# Altium schematic sheet Sheet_1_2024-03-04.schdoc
size 549 x 899 mm
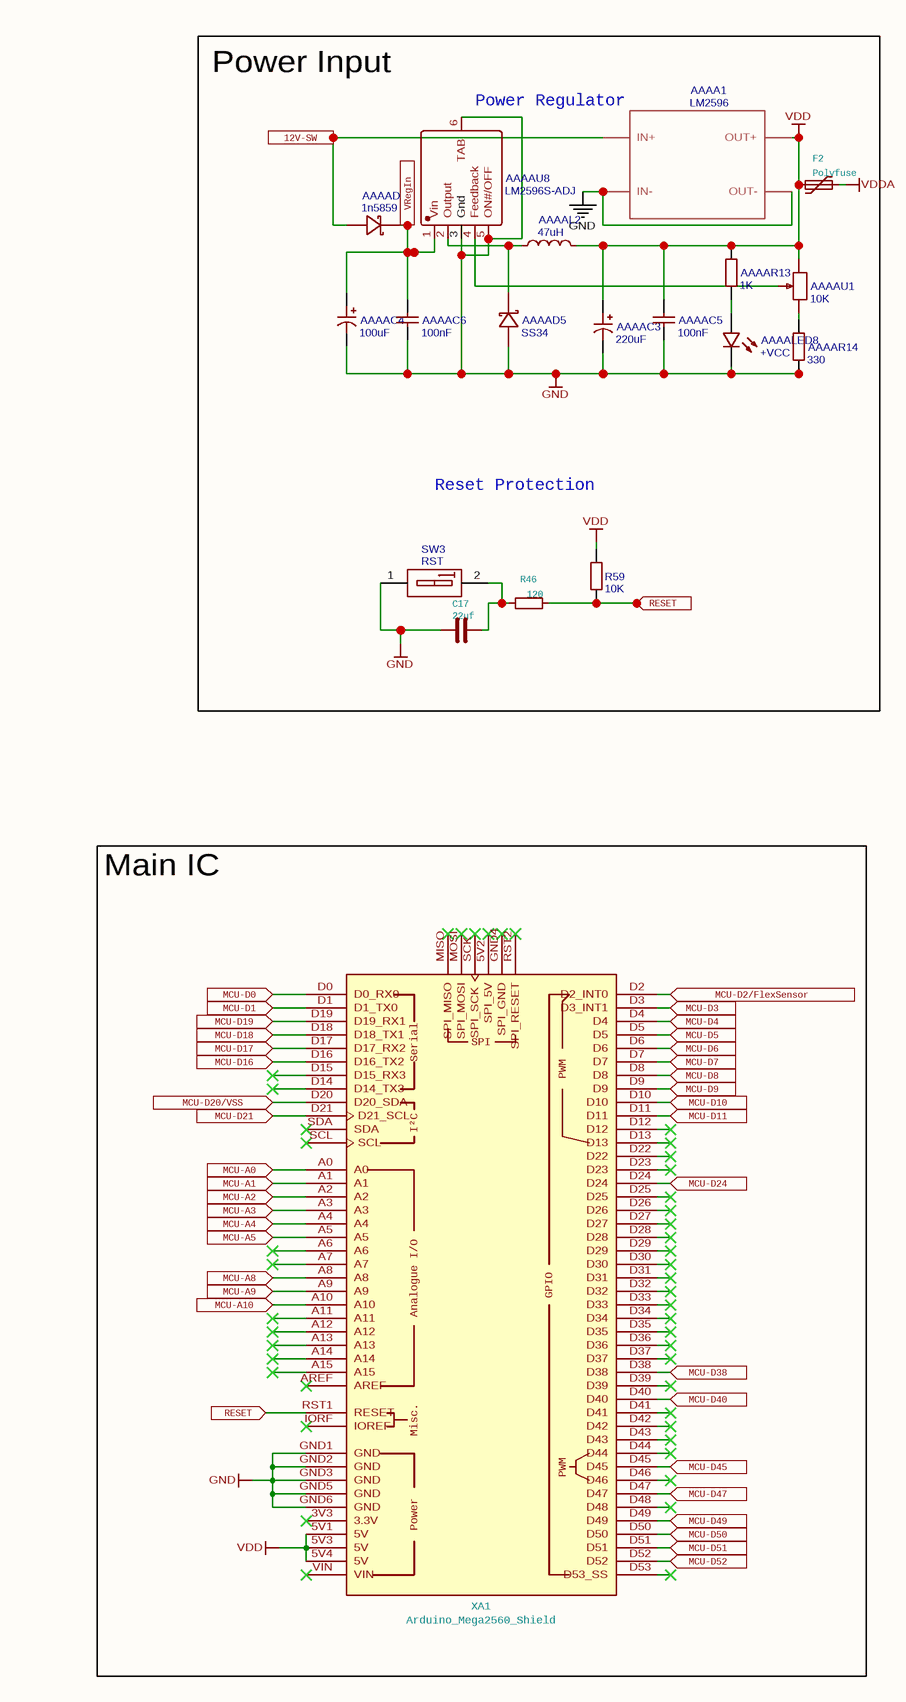
[diagram p0: Sheet_1_2024-03-04.schdoc, top left]
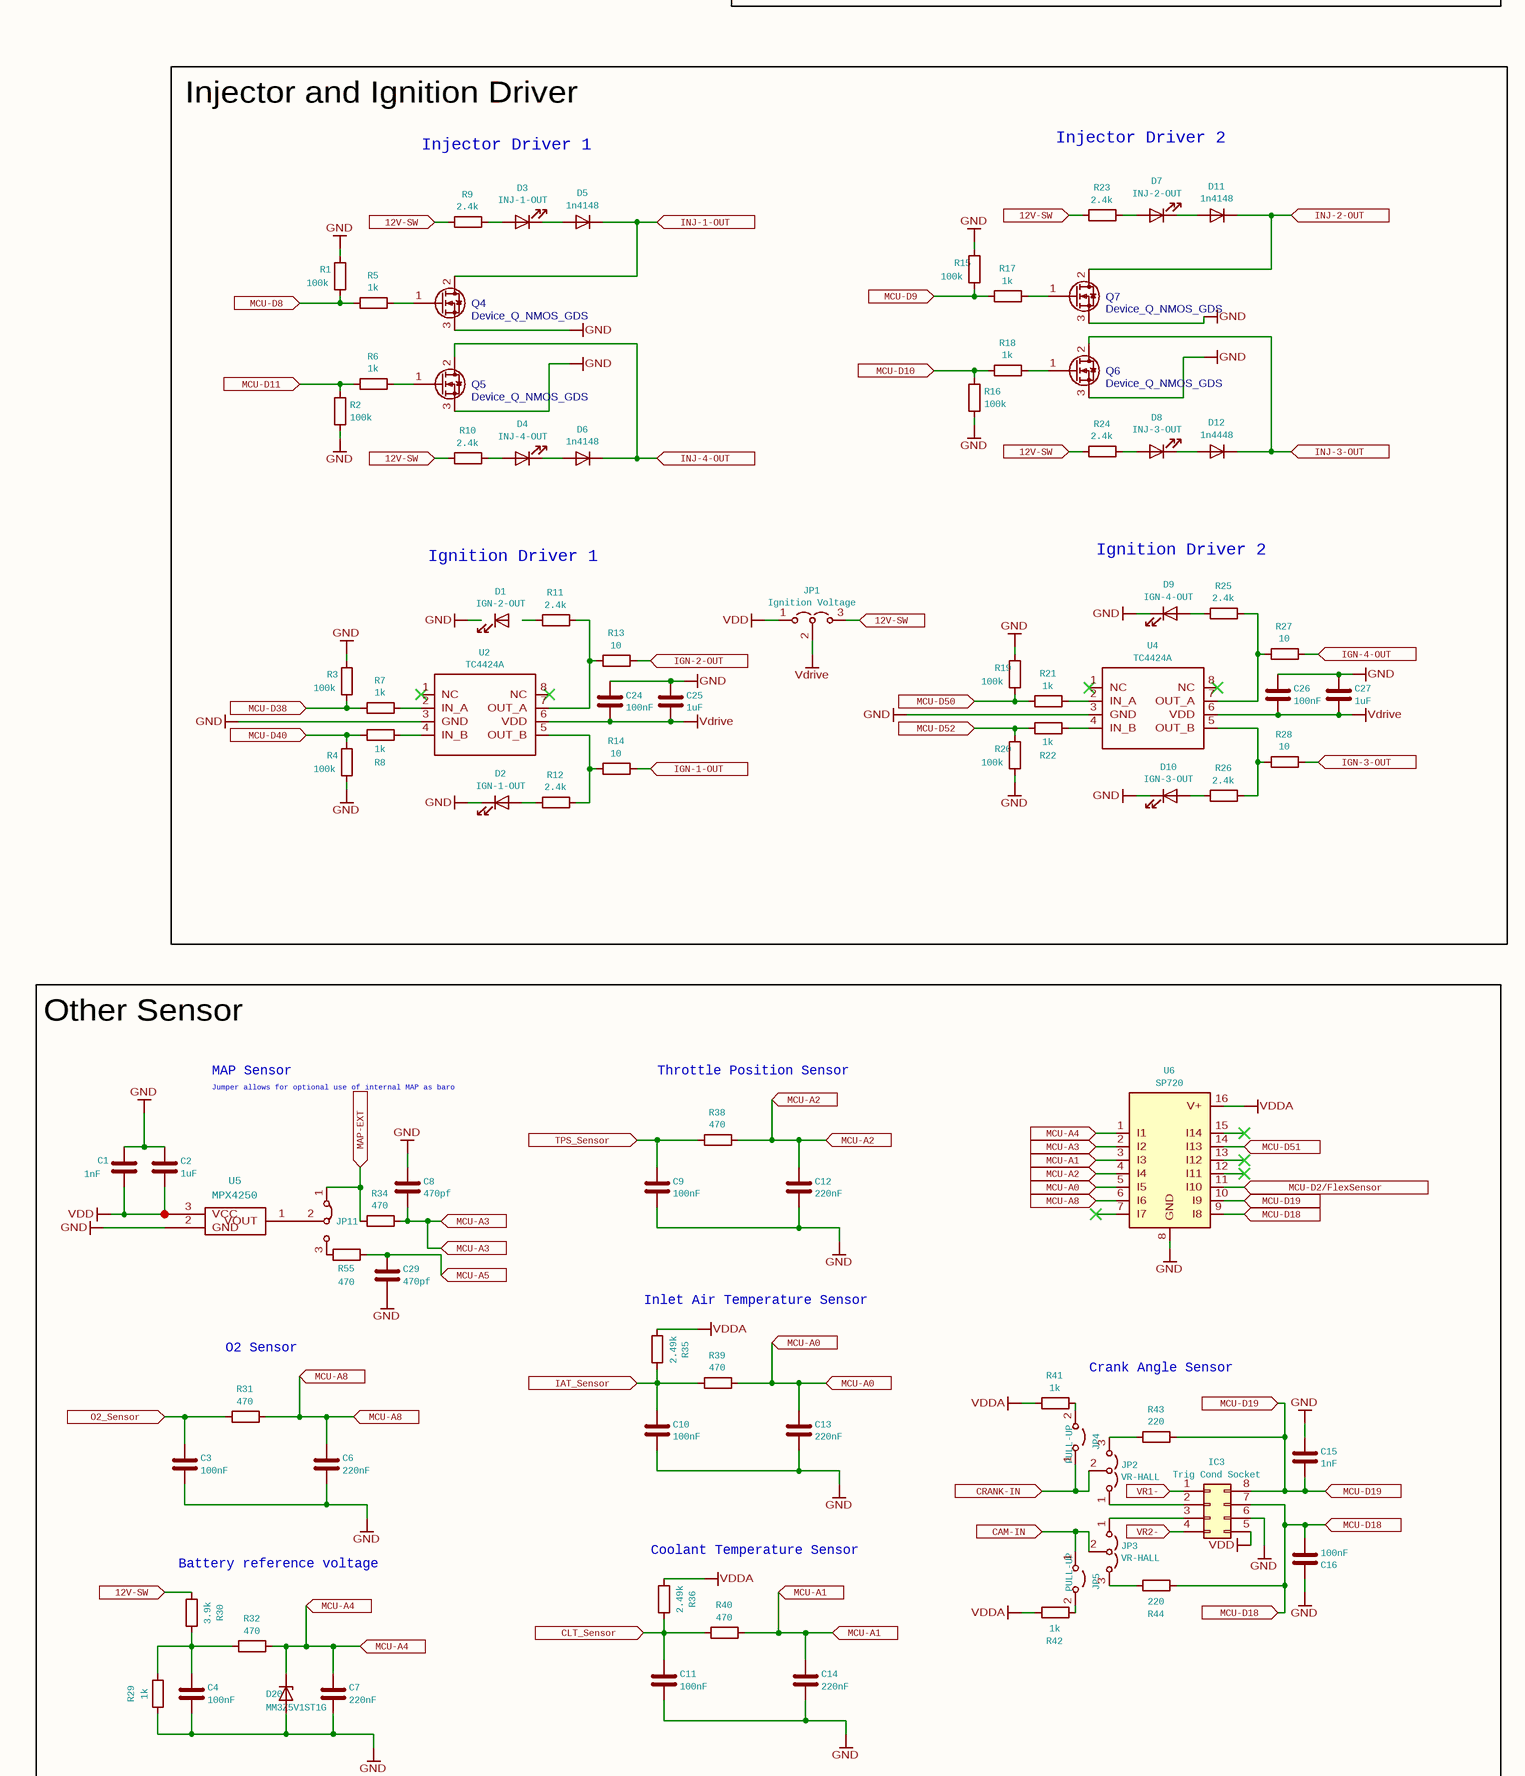
[diagram p1: Sheet_1_2024-03-04.schdoc, centre left]
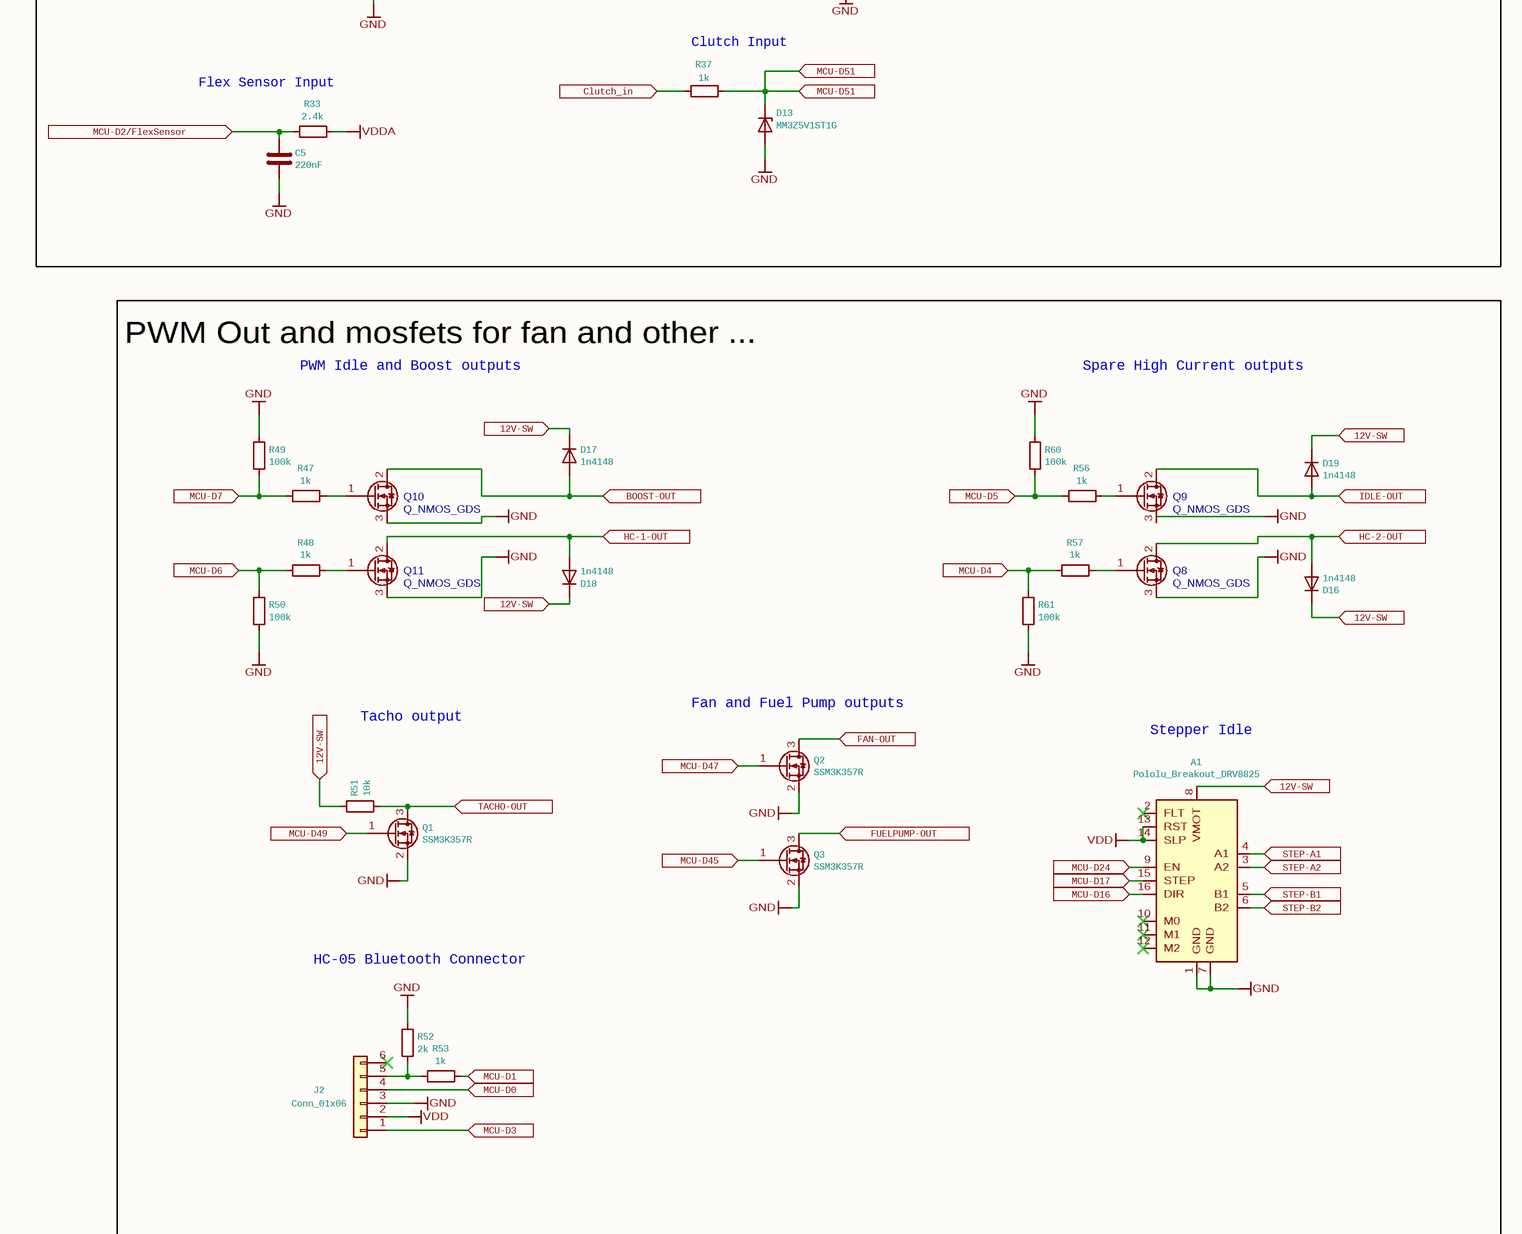
[diagram p2: Sheet_1_2024-03-04.schdoc, bottom left]
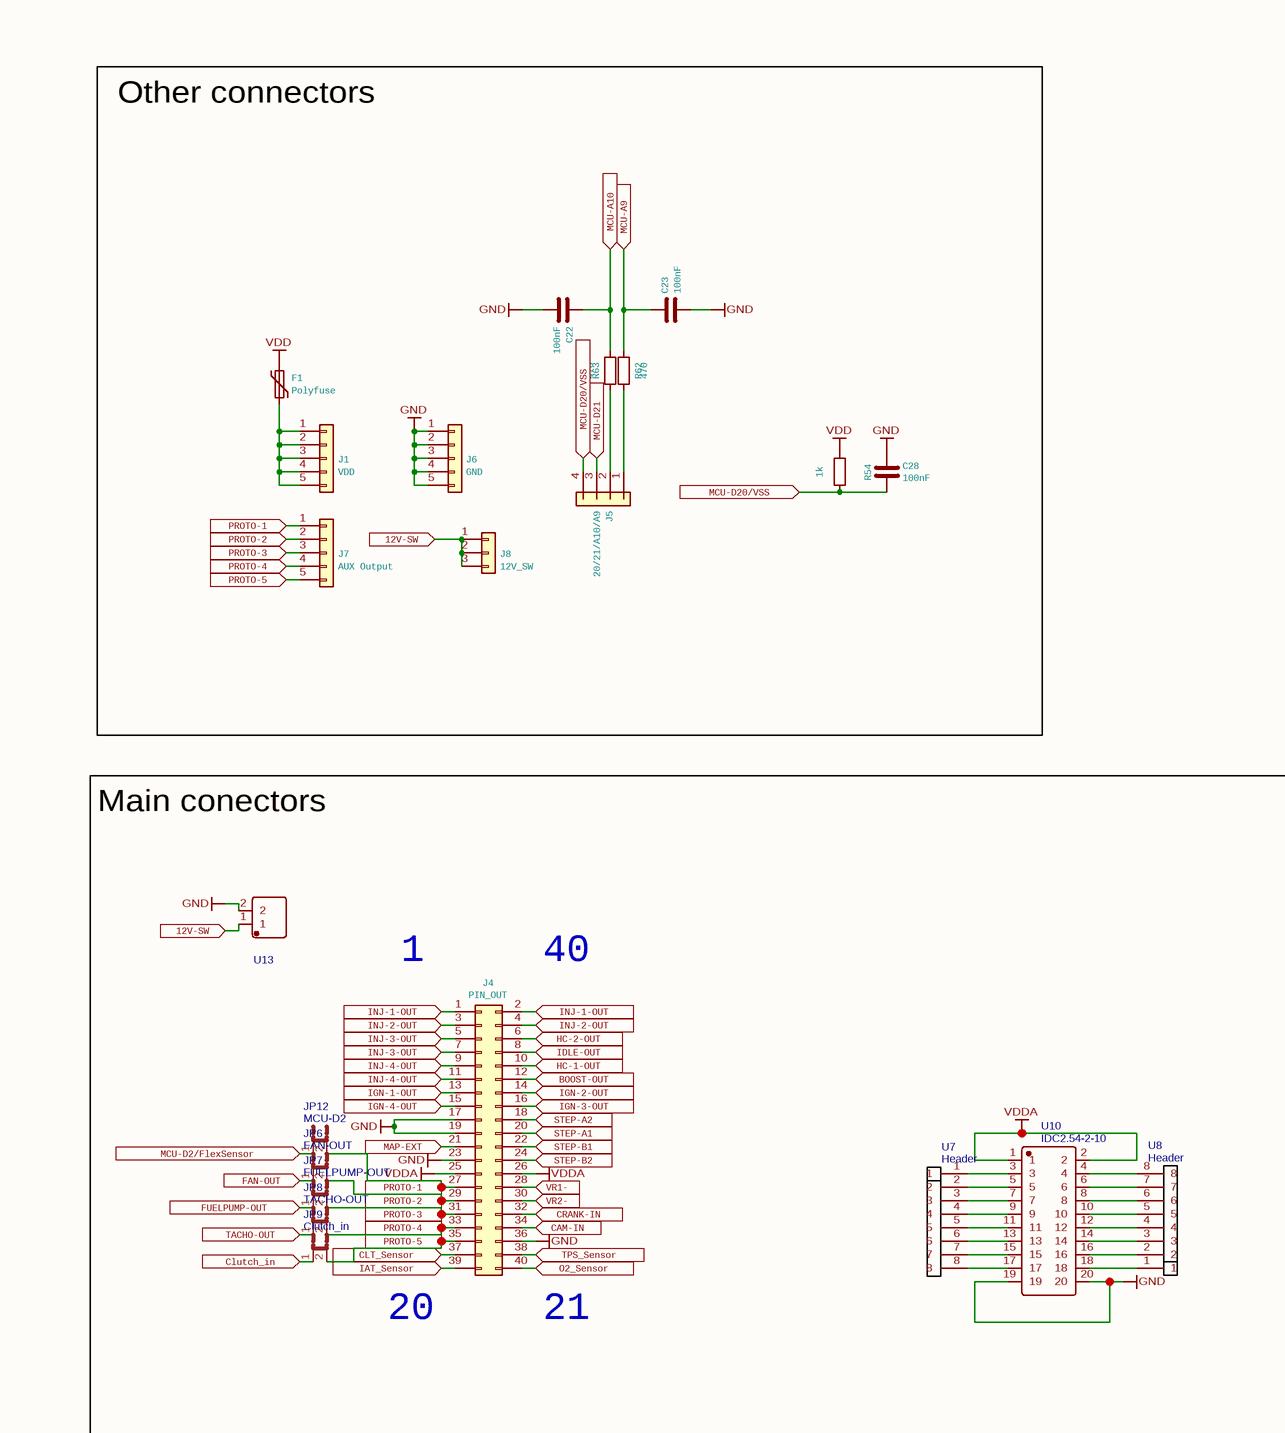
[diagram p3: Sheet_1_2024-03-04.schdoc, bottom right]

## Parts
A1  Pololu_Breakout_DRV8825  [POLOLU_BREAKOUT-16_15.2X20.3MM]
AAAA1  LM2596  [DC-DC-STEP-DOWN-LM2596]
AAAAC3  220uF  [CAP SMD 6.3 ~ 8 DIP 25V]
AAAAC4  100uF  [CAP SMD 6.3 ~ 8 DIP 25V]
AAAAC5  100nF  [C0805]
AAAAC6  100nF  [C0805]
AAAAD1  1n5859  [SMA_L4.3-W2.6-LS5.1-RD]
AAAAD5  SS34  [SMA_L4.3-W2.6-LS5.1-RD]
AAAAL2  47uH  [IND-SMD_L12.3-W12.3_SMDRI127]
AAAALED8  +VCC  [LED0805-R-RD]
AAAAR13  1K  [R0805]
AAAAR14  330  [R0805]
AAAAU1  10K  [RES-ADJ-SMD_SMD33-10K]
AAAAU8  LM2596S-ADJ  [TO-263-5_L10.2-W8.9-P1.70-BR]
C1  1nF  [C_0805_2012METRIC]
C2  1uF  [C_0805_2012METRIC]
C3  100nF  [C_0805_2012METRIC]
C4  100nF  [C_0805_2012METRIC]
C5  220nF  [C_0805_2012METRIC]
C6  220nF  [C_0805_2012METRIC]
C7  220nF  [C_0805_2012METRIC]
C8  470pf  [C_0805_2012METRIC]
C9  100nF  [C_0805_2012METRIC]
C10  100nF  [C_0805_2012METRIC]
C11  100nF  [C_0805_2012METRIC]
C12  220nF  [C_0805_2012METRIC]
C13  220nF  [C_0805_2012METRIC]
C14  220nF  [C_0805_2012METRIC]
C15  1nF  [C_0805_2012METRIC]
C16  100nF  [C_0805_2012METRIC]
C17  22uf  [C_0805_2012METRIC]
C22  100nF  [C_0805_2012METRIC]
C23  100nF  [C_0805_2012METRIC]
C24  100nF  [C_0805_2012METRIC]
C25  1uF  [C_0805_2012METRIC]
C26  100nF  [C_0805_2012METRIC]
C27  1uF  [C_0805_2012METRIC]
C28  100nF  [C_0805_2012METRIC]
C29  470pf  [C_0805_2012METRIC]
D1  IGN-2-OUT  [LED0805_RED]
D2  IGN-1-OUT  [LED0805_RED]
D3  INJ-1-OUT  [LED0805_RED]
D4  INJ-4-OUT  [LED0805_RED]
D5  1n4148  [D_SOD-323]
D6  1n4148  [D_SOD-323]
D7  INJ-2-OUT  [LED0805_RED]
D8  INJ-3-OUT  [LED0805_RED]
D9  IGN-4-OUT  [LED0805_RED]
D10  IGN-3-OUT  [LED0805_RED]
D11  1n4148  [D_SOD-323]
D12  1n4448  [D_SOD-323]
D13  MM3Z5V1ST1G  [D_SOD-323]
D16  1n4148  [D_SOD-123F]
D17  1n4148  [D_SOD-123F]
D18  1n4148  [D_SOD-123F]
D19  1n4148  [D_SOD-123F]
D20  MM3Z5V1ST1G  [D_SOD-323]
F1  Polyfuse  [FUSE_1812_4532METRIC]
F2  Polyfuse  [FUSE_1812_4532METRIC]
IC3  Trig Cond Socket  [DIP-8_W7.62MM_SOCKET]
J1  VDD  [PINHEADER_1X05_P2.54MM_VERTICAL]
J2  Conn_01x06  [PINHEADER_1X06_P2.54MM_VERTICAL]
J4  PIN_OUT  [IDC-HEADER_2X20_P2.54MM_VERTICAL]
J5  20/21/A10/A9  [PINHEADER_1X04_P2.54MM_VERTICAL]
J6  GND  [PINHEADER_1X05_P2.54MM_VERTICAL]
J7  AUX Output  [PINHEADER_1X05_P2.54MM_VERTICAL]
J8  12V_SW  [PINHEADER_1X03_P2.54MM_VERTICAL]
JP1  Ignition Voltage  [PINHEADER_1X03_P2.54MM_VERTICAL]
JP2  VR-HALL  [PINHEADER_1X03_P2.54MM_VERTICAL]
JP3  VR-HALL  [PINHEADER_1X03_P2.54MM_VERTICAL]
JP4  PULL-UP  [PINHEADER_1X02_P2.54MM_VERTICAL]
JP5  PULL-UP  [PINHEADER_1X02_P2.54MM_VERTICAL]
JP6  FAN-OUT  [JUMPER 2X1 (PIN= 2.54) SMD(0805)]
JP7  FUELPUMP-OUT  [JUMPER 2X1 (PIN= 2.54) SMD(0805)]
JP8  TACHO-OUT  [JUMPER 2X1 (PIN= 2.54) SMD(0805)]
JP9  Clutch_in  [JUMPER 2X1 (PIN= 2.54) SMD(0805)]
JP11  Jumper_MPX  [RES-ADJ-SMD_3P-10K-3-3]  (value not drawn)
JP12  MCU-D2  [JUMPER 2X1 (PIN= 2.54) SMD(0805)]
Q1  SSM3K357R  [SOT-23]
Q2  SSM3K357R  [SOT-23]
Q3  SSM3K357R  [SOT-23]
Q4  Device_Q_NMOS_GDS  [TO-220_Q_NMOS_GDS]
Q5  Device_Q_NMOS_GDS  [TO-220_Q_NMOS_GDS]
Q6  Device_Q_NMOS_GDS  [TO-220_Q_NMOS_GDS]
Q7  Device_Q_NMOS_GDS  [TO-220_Q_NMOS_GDS]
Q8  Q_NMOS_GDS  [TO-220_Q_NMOS_GDS]
Q9  Q_NMOS_GDS  [TO-220_Q_NMOS_GDS]
Q10  Q_NMOS_GDS  [TO-220_Q_NMOS_GDS]
Q11  Q_NMOS_GDS  [TO-220_Q_NMOS_GDS]
R1  100k  [R_0805_2012METRIC]
R2  100k  [R_0805_2012METRIC]
R3  100k  [R_0805_2012METRIC]
R4  100k  [R_0805_2012METRIC]
R5  1k  [R_0805_2012METRIC]
R6  1k  [R_0805_2012METRIC]
R7  1k  [R_0805_2012METRIC]
R8  1k  [R_0805_2012METRIC]
R9  2.4k  [R_0805_2012METRIC]
R10  2.4k  [R_0805_2012METRIC]
R11  2.4k  [R_0805_2012METRIC]
R12  2.4k  [R_0805_2012METRIC]
R13  10  [R_1206_3216METRIC]
R14  10  [R_1206_3216METRIC]
R15  100k  [R_0805_2012METRIC]
R16  100k  [R_0805_2012METRIC]
R17  1k  [R_0805_2012METRIC]
R18  1k  [R_0805_2012METRIC]
R19  100k  [R_0805_2012METRIC]
R20  100k  [R_0805_2012METRIC]
R21  1k  [R_0805_2012METRIC]
R22  1k  [R_0805_2012METRIC]
R23  2.4k  [R_0805_2012METRIC]
R24  2.4k  [R_0805_2012METRIC]
R25  2.4k  [R_0805_2012METRIC]
R26  2.4k  [R_0805_2012METRIC]
R27  10  [R_1206_3216METRIC]
R28  10  [R_1206_3216METRIC]
R29  1k  [R_0805_2012METRIC]
R30  3.9k  [R_0805_2012METRIC]
R31  470  [R_0805_2012METRIC]
R32  470  [R_0805_2012METRIC]
R33  2.4k  [R_0805_2012METRIC]
R34  470  [R_0805_2012METRIC]
R35  2.49k  [R_0805_2012METRIC]
R36  2.49k  [R_0805_2012METRIC]
R37  1k  [R_0805_2012METRIC]
R38  470  [R_0805_2012METRIC]
R39  470  [R_0805_2012METRIC]
R40  470  [R_0805_2012METRIC]
R41  1k  [R_0805_2012METRIC]
R42  1k  [R_0805_2012METRIC]
R43  220  [R_0805_2012METRIC]
R44  220  [R_0805_2012METRIC]
R46  120  [R_0805_2012METRIC]
R47  1k  [R_0805_2012METRIC]
R48  1k  [R_0805_2012METRIC]
R49  100k  [R_0805_2012METRIC]
R50  100k  [R_0805_2012METRIC]
R51  10k  [R_0805_2012METRIC]
R52  2k  [R_0805_2012METRIC]
R53  1k  [R_0805_2012METRIC]
R54  1k  [R_0805_2012METRIC]
R55  470  [R_0805_2012METRIC]
R56  1k  [R_0805_2012METRIC]
R57  1k  [R_0805_2012METRIC]
R59  10K  [R0805]
R60  100k  [R_0805_2012METRIC]
R61  100k  [R_0805_2012METRIC]
R62  470  [R_0805_2012METRIC]
R63  470  [R_0805_2012METRIC]
SW3  RST  [SW-SMD_L5.4-W2.8-LS8.2]
U2  TC4424A  [SOIC-8_3.9X4.9MM_P1.27MM]
U4  TC4424A  [SOIC-8_3.9X4.9MM_P1.27MM]
U5  MPX4250  [MPX4250]
U6  SP720  [SOIC-16_3.9X9.9MM_P1.27MM]
U7  Header  [1X8 HEADER (PIN = 2.54)]
U8  Header  [1X8 HEADER (PIN = 2.54)]
U10  IDC2.54-2-10  [IDC-TH_20P-P2.54_ZX-IDC2.54-2-10PZZ]
U13  Power Input  [PHONIX 2PIN (5.08MM)]  (value not drawn)
XA1  Arduino_Mega2560_Shield  [ARDUINO_MEGA2560_SHIELD_IO_ONLY]

## Blocks framed on the sheet
Power Input: AAAA1 AAAAC3-AAAAC6 AAAAD1 AAAAD5 AAAAL2 AAAALED8 AAAAR13 AAAAR14 AAAAU1 AAAAU8 C17 F2 R46 R59 SW3
Main IC: XA1
Injector and Ignition Driver: C24-C27 D1-D12 JP1 Q4-Q7 R1-R28 U2 U4
Other Sensor: C1-C16 C29 D13 D20 IC3 JP2-JP5 JP11 R29-R44 R55 U5 U6
Other connectors: C22 C23 C28 F1 J1 J5-J8 R54 R62 R63
PWM Out and mosfets for fan and other ...: A1 D16-D19 J2 Q1-Q3 Q8-Q11 R47-R53 R56 R57 R60 R61

## Ports
12V-SW (in), BOOST-OUT (in), CAM-IN (in), CLT_Sensor (in), Clutch_in (in), CRANK-IN (in), FAN-OUT (in), FUELPUMP-OUT (in), HC-1-OUT (in), HC-2-OUT (in), IAT_Sensor (in), IDLE-OUT (in), IGN-1-OUT (in), IGN-2-OUT (in), IGN-3-OUT (in), IGN-4-OUT (in), INJ-1-OUT (in), INJ-2-OUT (in), INJ-3-OUT (in), INJ-4-OUT (in), MAP-EXT (in), MCU-A0 (in), MCU-A1 (in), MCU-A2 (in), MCU-A3 (in), MCU-A4 (in), MCU-A5 (in), MCU-A8 (in), MCU-A9 (in), MCU-A10 (in), MCU-D0 (in), MCU-D1 (in), MCU-D2/FlexSensor (in), MCU-D3 (in), MCU-D4 (in), MCU-D5 (in), MCU-D6 (in), MCU-D7 (in), MCU-D8 (in), MCU-D9 (in), MCU-D10 (in), MCU-D11 (in), MCU-D16 (in), MCU-D17 (in), MCU-D18 (in), MCU-D19 (in), MCU-D20/VSS (in), MCU-D21 (in), MCU-D24 (in), MCU-D38 (in), MCU-D40 (in), MCU-D45 (in), MCU-D47 (in), MCU-D49 (in), MCU-D50 (in), MCU-D51 (in), MCU-D52 (in), O2_Sensor (in), PROTO-1 (in), PROTO-2 (in), PROTO-3 (in), PROTO-4 (in), PROTO-5 (in), RESET (in), STEP-A1 (in), STEP-A2 (in), STEP-B1 (in), STEP-B2 (in), TACHO-OUT (in), TPS_Sensor (in), VR1- (in), VR2- (in), VRegIn (in)

## Nets
GND: A1.1(GND) A1.7(GND) AAAA1.IN- AAAA1.OUT- AAAAC3.2 AAAAC4.2 AAAAC5.1 AAAAC6.1 AAAAD5.2(A) AAAALED8.2(C) AAAAR14.1 AAAAU8.3(Gnd) AAAAU8.5(ON#/OFF) AAAAU8.6(TAB) C1.1 C2.1 C3.2 C4.2 C5.2 C6.2 C7.2 C8.1 C9.2 C10.2 C11.2 C12.2 C13.2 C14.2 C15.1 C16.1 C17.1 C22.2 C23.2 C24.1 C25.1 C26.1 C27.1 C28.1 C29.2 D2.1(K) D9.1(K) D10.1(K) D13.2(A) D20.2(A) IC3.6(Pin_6) J2.3(Pin_3) J4.17(Pin_17) J4.19(Pin_19) J4.23(Pin_23) J4.36(Pin_36) J6.1(Pin_1) J6.2(Pin_2) J6.3(Pin_3) J6.4(Pin_4) J6.5(Pin_5) Q1.2(S) Q2.2(S) Q3.2(S) Q4.3(S) Q5.3(S) Q6.3(S) Q7.3(S) Q8.3(S) Q9.3(S) Q10.3(S) Q11.3(S) R1.2 R2.1 R3.2 R4.1 R15.2 R16.1 R19.2 R20.1 R29.1 R49.2 R50.1 R52.2 R60.2 R61.1 SW3.1(A1) U2.3(GND) U4.3(GND) U5.2(GND) U6.8(GND) U10.19 U10.20 U13.2 XA1.GND1(GND) XA1.GND2(GND) XA1.GND3(GND) XA1.GND5(GND) XA1.GND6(GND)
VDD: A1.13(RST) A1.14(SLP) AAAA1.OUT+ AAAAC3.1 AAAAC5.2 AAAAL2.2 AAAAR13.2 AAAAU1.3 C1.2 C2.2 F1.1 F2.1 IC3.5(Pin_5) J2.2(Pin_2) JP1.1(A) R54.2 R59.1 U5.3(VCC) XA1.5V1(5V) XA1.5V3(5V) XA1.5V4(5V)
VDDA: F2.2 J4.25(Pin_25) J4.26(Pin_26) R33.1 R35.2 R36.2 R41.2 R42.2 U6.16(V+) U10.1 U10.2
Vdrive: C24.2 C25.2 C26.2 C27.2 JP1.2(C) U2.6(VDD) U4.6(VDD)
12V-SW: A1.8(VMOT) AAAA1.IN+ AAAAD1.2(A) D16.1(K) D17.1(K) D18.1(K) D19.1(K) J8.1(Pin_1) J8.2(Pin_2) J8.3(Pin_3) JP1.3(B) R9.2 R10.2 R23.2 R24.2 R30.2 R51.2 U13.1 ; port 12V-SW
BOOST-OUT: D17.2(A) J4.12(Pin_12) Q10.2(D) ; port BOOST-OUT
CAM-IN: J4.34(Pin_34) JP3.2(C) JP5.1(A) ; port CAM-IN
CLT_Sensor: C11.1 J4.37(Pin_37) R36.1 R40.2 ; port CLT_Sensor
Clutch_in: JP9.1 R37.1 ; port Clutch_in
CRANK-IN: J4.32(Pin_32) JP2.2(C) JP4.1(A) ; port CRANK-IN
FAN-OUT: JP6.1 Q2.3(D) ; port FAN-OUT
FUELPUMP-OUT: JP7.1 Q3.3(D) ; port FUELPUMP-OUT
HC-1-OUT: D18.2(A) J4.10(Pin_10) Q11.2(D) ; port HC-1-OUT
HC-2-OUT: D16.2(A) J4.6(Pin_6) Q8.2(D) ; port HC-2-OUT
IAT_Sensor: C10.1 J4.39(Pin_39) R35.1 R39.2 ; port IAT_Sensor
IDLE-OUT: D19.2(A) J4.8(Pin_8) Q9.2(D) ; port IDLE-OUT
IGN-1-OUT: J4.13(Pin_13) R14.1 ; port IGN-1-OUT
IGN-2-OUT: J4.14(Pin_14) R13.1 ; port IGN-2-OUT
IGN-3-OUT: J4.16(Pin_16) R28.1 ; port IGN-3-OUT
IGN-4-OUT: J4.15(Pin_15) R27.1 ; port IGN-4-OUT
INJ-1-OUT: D5.1(K) J4.1(Pin_1) J4.2(Pin_2) Q4.2(D) ; port INJ-1-OUT
INJ-2-OUT: D11.1(K) J4.3(Pin_3) J4.4(Pin_4) Q7.2(D) ; port INJ-2-OUT
INJ-3-OUT: D12.1(K) J4.5(Pin_5) J4.7(Pin_7) Q6.2(D) ; port INJ-3-OUT
INJ-4-OUT: D6.1(K) J4.9(Pin_9) J4.11(Pin_11) Q5.2(D) ; port INJ-4-OUT
MAP-EXT: J4.21(Pin_21) JP11.1(A) R34.2 ; port MAP-EXT
MCU-A0: C13.1 R39.1 U6.5(I5) XA1.A0 ; port MCU-A0
MCU-A1: C14.1 R40.1 U6.3(I3) XA1.A1 ; port MCU-A1
MCU-A2: C12.1 R38.1 U6.4(I4) XA1.A2 ; port MCU-A2
MCU-A3: C8.2 R34.1 U6.2(I2) XA1.A3 ; port MCU-A3
MCU-A4: C7.1 D20.1(K) R32.1 U6.1(I1) XA1.A4 ; port MCU-A4
MCU-A5: C29.1 R55.1 XA1.A5 ; port MCU-A5
MCU-A8: C6.1 R31.1 U6.6(I6) XA1.A8 ; port MCU-A8
MCU-A9: C23.1 R63.1 XA1.A9 ; port MCU-A9
MCU-A10: C22.1 R62.2 XA1.A10 ; port MCU-A10
MCU-D0: J2.4(Pin_4) XA1.D0(D0_RX0) ; port MCU-D0
MCU-D1: R53.1 XA1.D1(D1_TX0) ; port MCU-D1
MCU-D2/FlexSensor: C5.1 JP12.1 R33.2 U6.11(I10) XA1.D2(D2_INT0) ; port MCU-D2/FlexSensor
MCU-D3: J2.1(Pin_1) XA1.D3(D3_INT1) ; port MCU-D3
MCU-D4: R57.2 R61.2 XA1.D4 ; port MCU-D4
MCU-D5: R56.2 R60.1 XA1.D5 ; port MCU-D5
MCU-D6: R48.2 R50.2 XA1.D6 ; port MCU-D6
MCU-D7: R47.2 R49.1 XA1.D7 ; port MCU-D7
MCU-D8: R1.1 R5.2 XA1.D8 ; port MCU-D8
MCU-D9: R15.1 R17.2 XA1.D9 ; port MCU-D9
MCU-D10: R16.2 R18.2 XA1.D10 ; port MCU-D10
MCU-D11: R2.2 R6.2 XA1.D11 ; port MCU-D11
MCU-D16: A1.16(DIR) XA1.D16(D16_TX2) ; port MCU-D16
MCU-D17: A1.15(STEP) XA1.D17(D17_RX2) ; port MCU-D17
MCU-D18: C16.2 IC3.7(Pin_7) R44.1 U6.9(I8) XA1.D18(D18_TX1) ; port MCU-D18
MCU-D19: C15.2 IC3.8(Pin_8) R43.1 U6.10(I9) XA1.D19(D19_RX1) ; port MCU-D19
MCU-D20/VSS: C28.2 J5.4(Pin_4) R54.1 XA1.D20(D20_SDA) ; port MCU-D20/VSS
MCU-D21: J5.3(Pin_3) XA1.D21(D21_SCL) ; port MCU-D21
MCU-D24: A1.9(EN) XA1.D24 ; port MCU-D24
MCU-D38: R3.1 R7.2 XA1.D38 ; port MCU-D38
MCU-D40: R4.2 R8.2 XA1.D40 ; port MCU-D40
MCU-D45: Q3.1(G) XA1.D45 ; port MCU-D45
MCU-D47: Q2.1(G) XA1.D47 ; port MCU-D47
MCU-D49: Q1.1(G) XA1.D49 ; port MCU-D49
MCU-D50: R19.1 R21.2 XA1.D50 ; port MCU-D50
MCU-D51: D13.1(K) R37.2 U6.14(I13) XA1.D51 ; port MCU-D51
MCU-D52: R20.2 R22.2 XA1.D52 ; port MCU-D52
O2_Sensor: C3.1 J4.40(Pin_40) R31.2 ; port O2_Sensor
PROTO-1: J4.27(Pin_27) J7.1(Pin_1) JP12.2 ; port PROTO-1
PROTO-2: J4.29(Pin_29) J7.2(Pin_2) JP6.2 ; port PROTO-2
PROTO-3: J4.31(Pin_31) J7.3(Pin_3) JP7.2 ; port PROTO-3
PROTO-4: J4.33(Pin_33) J7.4(Pin_4) JP8.2 ; port PROTO-4
PROTO-5: J4.35(Pin_35) J7.5(Pin_5) JP9.2 ; port PROTO-5
RESET: R46.1 R59.2 XA1.RST1(RESET) ; port RESET
STEP-A1: A1.4(A1) J4.20(Pin_20) ; port STEP-A1
STEP-A2: A1.3(A2) J4.18(Pin_18) ; port STEP-A2
STEP-B1: A1.5(B1) J4.22(Pin_22) ; port STEP-B1
STEP-B2: A1.6(B2) J4.24(Pin_24) ; port STEP-B2
TACHO-OUT: JP8.1 Q1.3(D) R51.1 ; port TACHO-OUT
TPS_Sensor: C9.1 J4.38(Pin_38) R38.2 ; port TPS_Sensor
VR1-: IC3.1(Pin_1) J4.28(Pin_28) ; port VR1-
VR2-: IC3.4(Pin_4) J4.30(Pin_30) ; port VR2-
VRegIn: AAAAC4.1 AAAAC6.2 AAAAD1.1(K) AAAAU8.1(Vin) ; port VRegIn
NetAAAAD5_1: AAAAD5.1(K) AAAAL2.1 AAAAU8.2(Output)
NetAAAALED8_1: AAAALED8.1(A) AAAAR13.1
NetAAAAR14_2: AAAAR14.2 AAAAU1.1
NetAAAAU1_2: AAAAU1.2 AAAAU8.4(Feedback)
NetC4_1: C4.1 R29.2 R30.1 R32.2
NetC17_2: C17.2 R46.2 SW3.2(B1)
NetD2_2: D2.2(A) R12.2
NetD3_1: D3.1(K) D5.2(A)
NetD3_2: D3.2(A) R9.1
NetD4_1: D4.1(K) D6.2(A)
NetD4_2: D4.2(A) R10.1
NetD7_1: D7.1(K) D11.2(A)
NetD7_2: D7.2(A) R23.1
NetD8_1: D8.1(K) D12.2(A)
NetD8_2: D8.2(A) R24.1
NetD9_2: D9.2(A) R25.2
NetD10_2: D10.2(A) R26.2
NetF1_2: F1.2 J1.1(Pin_1) J1.2(Pin_2) J1.3(Pin_3) J1.4(Pin_4) J1.5(Pin_5)
NetIC3_2: IC3.2(Pin_2) JP2.1(A)
NetIC3_3: IC3.3(Pin_3) JP3.1(A)
NetJ2_5: J2.5(Pin_5) R52.1 R53.2
NetJ5_1: J5.1(Pin_1) R63.2
NetJ5_2: J5.2(Pin_2) R62.1
NetJP2_3: JP2.3(B) R43.2
NetJP3_3: JP3.3(B) R44.2
NetJP4_2: JP4.2(B) R41.1
NetJP5_2: JP5.2(B) R42.1
NetJP11_2: JP11.2(C) U5.1(VOUT)
NetJP11_3: JP11.3(B) R55.2
NetQ4_1: Q4.1(G) R5.1
NetQ5_1: Q5.1(G) R6.1
NetQ6_1: Q6.1(G) R18.1
NetQ7_1: Q7.1(G) R17.1
NetQ8_1: Q8.1(G) R57.1
NetQ9_1: Q9.1(G) R56.1
NetQ10_1: Q10.1(G) R47.1
NetQ11_1: Q11.1(G) R48.1
NetR7_1: R7.1 U2.2(IN_A)
NetR8_1: R8.1 U2.4(IN_B)
NetR11_1: R11.1 R13.2 U2.7(OUT_A)
NetR12_1: R12.1 R14.2 U2.5(OUT_B)
NetR21_1: R21.1 U4.2(IN_A)
NetR22_1: R22.1 U4.4(IN_B)
NetR25_1: R25.1 R27.2 U4.7(OUT_A)
NetR26_1: R26.1 R28.2 U4.5(OUT_B)
NetU7_1: U7.1 U10.3
NetU7_2: U7.2 U10.5
NetU7_3: U7.3 U10.7
NetU7_4: U7.4 U10.9
NetU7_5: U7.5 U10.11
NetU7_6: U7.6 U10.13
NetU7_7: U7.7 U10.15
NetU7_8: U7.8 U10.17
NetU8_1: U8.1 U10.18
NetU8_2: U8.2 U10.16
NetU8_3: U8.3 U10.14
NetU8_4: U8.4 U10.12
NetU8_5: U8.5 U10.10
NetU8_6: U8.6 U10.8
NetU8_7: U8.7 U10.6
NetU8_8: U8.8 U10.4

Not connected (* = marked no-connect by the designer): A1 2(FLT)* 10(M0)* 11(M1)* 12(M2)*; J2 6(Pin_6)*; R11 2; U2 1(NC)* 8(NC)*; U4 1(NC)* 8(NC)*; U6 7(I7)* 12(I11)* 13(I12)* 15(I14)*; XA1 3V3(3.3V)* 5V2(SPI_5V)* A6* A7* A11* A12* A13* A14* A15* AREF* D12* D13* D14(D14_TX3)* D15(D15_RX3)* D22* D23* D25* D26* D27* D28* D29* D30* D31* D32* D33* D34* D35* D36* D37* D39* D41* D42* D43* D44* D46* D48* D53(D53_SS)* GND4(SPI_GND)* IORF(IOREF)* MISO(SPI_MISO)* MOSI(SPI_MOSI)* RST2(SPI_RESET)* SCK(SPI_SCK)* SCL* SDA* VIN*

## Notes on the sheet
- (near AAAAU8) Power Regulator
- Reset Protection
- Injector Driver 1
- Injector Driver 2
- Ignition Driver 2
- Ignition Driver 1
- MAP Sensor
- Jumper allows for optional use of internal MAP as baro
- Throttle Position Sensor
- O2 Sensor
- (near R35) Inlet Air Temperature Sensor
- Crank Angle Sensor
- (near R36) Coolant Temperature Sensor
- (near R30) Battery reference voltage
- Flex Sensor Input
- (near R37) Clutch Input
- PWM Idle and Boost outputs
- Spare High Current outputs
- Main conectors
- Tacho output
- (near Q2) Fan and Fuel Pump outputs
- Stepper Idle
- 1
- 40
- HC-05 Bluetooth Connector
- 20
- (near J4) 21
- (in symbol Arduino_Mega2560_Shield) Serial; SPI; PWM; I²C; Analogue I/O; GPIO; Misc.; Power

## Library data of the parts
AAAA1 = LM2596: Contributor: Zufar Aditama; spicePre: ?; spiceSymbolName: DC-DC-STEP-DOWN-LM2596
AAAAC3 = 220uF: Manufacturer: SAMYOUNG(韩国三莹); Manufacturer Part: MVK16V100UF6.3*6; nameAlias: Capacitance; Contributor: amir slz; Supplier Part: C2693600; JLCPCB Part Class: Extended Part; spicePre: C; spiceSymbolName: CAP 6.3 ~ 0.8 DIP 25v
AAAAC4 = 100uF: Manufacturer: SAMYOUNG(韩国三莹); Manufacturer Part: MVK16V100UF6.3*6; nameAlias: Capacitance; Contributor: amir slz; Supplier Part: C2693600; JLCPCB Part Class: Extended Part; spicePre: C; spiceSymbolName: CAP 6.3 ~ 0.8 DIP 25v
AAAAC5 AAAAC6 = 100nF: Manufacturer: WTC; Manufacturer Part: 0805F104Z500; nameAlias: Capacitance; Contributor: LCSC; Supplier: LCSC; Supplier Part: C89574; JLCPCB Part Class: Extended Part; spicePre: C; spiceSymbolName: 0805F104Z500
AAAAD1 = 1n5859: Manufacturer: null; Manufacturer Part: SS34-55℃~+125℃; Contributor: lcsc; Supplier: LCSC; Supplier Part: C9900022445; spicePre: D; spiceSymbolName: SS34-55℃~+125℃
AAAAD5 = SS34: Manufacturer: null; Manufacturer Part: SS34-55℃~+125℃; Contributor: lcsc; Supplier: LCSC; Supplier Part: C9900022445; spicePre: D; spiceSymbolName: SS34-55℃~+125℃
AAAAL2 = 47uH: Manufacturer: SHOU HAN(首韩); Manufacturer Part: CYH127-47UH; nameAlias: Inductance; Contributor: lcsc; Supplier: LCSC; Supplier Part: C2929503; JLCPCB Part Class: Extended Part; spicePre: L; spiceSymbolName: CYH127-47UH
AAAALED8 = +VCC: Manufacturer: Everlight Elec; Manufacturer Part: 17-215/G6C-BM1N2L/3T; Contributor: LCSC; Supplier: LCSC; Supplier Part: C94615; spicePre: L; spiceSymbolName: 17-215/G6C-BM1N2L/3T
AAAAR13 = 1K: Manufacturer: null; Manufacturer Part: CR0805-JW-393ELF; Contributor: lcsc; Supplier: LCSC; Supplier Part: C9900016807; link: https://atta.szlcsc.comnull; JLCPCB Part Class: Extended Part; spicePre: R; spiceSymbolName: CR0805-JW-393ELF
AAAAR14 = 330: Manufacturer: null; Manufacturer Part: CR0805-JW-393ELF; Contributor: lcsc; Supplier: LCSC; Supplier Part: C9900016807; link: https://atta.szlcsc.comnull; JLCPCB Part Class: Extended Part; spicePre: R; spiceSymbolName: CR0805-JW-393ELF
AAAAU1 = 10K: Manufacturer: null; Manufacturer Part: SMD33-10K; Contributor: LCSC; Supplier: LCSC; Supplier Part: C9900001299; JLCPCB Part Class: Extended Part; spicePre: U; spiceSymbolName: SMD33-10K
AAAAU8 = LM2596S-ADJ: Manufacturer: UMW(Youtai Semiconductor Co., Ltd.); Contributor: LCSC; Supplier: LCSC; Supplier Part: C347423; Manufacturer Part: LM2596S-ADJ; JLCPCB Part Class: Extended Part; spicePre: U; spiceSymbolName: LM2596S-ADJ
C1 C15 = 1nF: Manufacturer_Name: Yageo; Manufacturer_Part_Number: CC0805KRX7R9BB103; Digikey Part Number: 311-1136-1-ND; URL: https://www.digikey.com/product-detail/en/yageo/CC0805KRX7R9BB103/311-1136-1-ND/303046
C2 C25 C27 = 1uF: Manufacturer_Name: Yageo; Manufacturer_Part_Number: CC0805KKX7R7BB105; Digikey Part Number: 311-1365-1-ND; URL: https://www.digikey.com/product-detail/en/yageo/CC0805KKX7R7BB105/311-1365-1-ND/2103149
C3 C4 C9-C11 C16 C22-C24 C26 C28 = 100nF: Manufacturer_Name: Yageo; Manufacturer_Part_Number: CC0805KRX7R9BB104; Digikey Part Number: 311-1140-1-ND; URL: https://www.digikey.com.au/product-detail/en/yageo/CC0805KRX7R9BB104/311-1140-1-ND/303050
C5-C7 C12-C14 = 220nF: Manufacturer_Name: Samsung; Manufacturer_Part_Number: CL21B224KOCNNNC; Digikey Part Number: 1276-1284-1-ND; URL: https://www.digikey.com/product-detail/en/samsung-electro-mechanics-america-inc/CL21B224KOCNNNC/1276-1284-1-ND/3889370
C8 C29 = 470pf: Manufacturer_Name: Yageo; Manufacturer_Part_Number: CC0805KRX7R9BB471; Digikey Part Number: 311-1124-1-ND; URL: https://www.digikey.com/product-detail/en/yageo/CC0805KRX7R9BB471/311-1124-1-ND/303034
C17 = 22uf: Manufacturer_Name: Yageo; Manufacturer_Part_Number: CC0805KRX7R9BB104; Digikey Part Number: 311-1140-1-ND; URL: https://www.digikey.com.au/product-detail/en/yageo/CC0805KRX7R9BB104/311-1140-1-ND/303050
D1 = IGN-2-OUT: Manufacturer_Name: Osram; Manufacturer_Part_Number: LH R974-LP-1; Digikey Part Number: 475-1415-1-ND; URL: https://www.digikey.com/product-detail/en/osram-opto-semiconductors-inc/LH-R974-LP-1/475-1415-1-ND/1802604
D2 = IGN-1-OUT: Manufacturer_Name: Osram; Manufacturer_Part_Number: LH R974-LP-1; Digikey Part Number: 475-1415-1-ND; URL: https://www.digikey.com/product-detail/en/osram-opto-semiconductors-inc/LH-R974-LP-1/475-1415-1-ND/1802604
D3 = INJ-1-OUT: Manufacturer_Name: Osram; Manufacturer_Part_Number: LH R974-LP-1; Digikey Part Number: 475-1415-1-ND; URL: https://www.digikey.com/product-detail/en/osram-opto-semiconductors-inc/LH-R974-LP-1/475-1415-1-ND/1802604
D4 = INJ-4-OUT: Manufacturer_Name: Osram; Manufacturer_Part_Number: LH R974-LP-1; Digikey Part Number: 475-1415-1-ND; URL: https://www.digikey.com/product-detail/en/osram-opto-semiconductors-inc/LH-R974-LP-1/475-1415-1-ND/1802604
D5 D6 D11 = 1n4148: Manufacturer_Name: MCC; Manufacturer_Part_Number: 1N4448WX-TP; Digikey Part Number: 1N4448WXTPMSCT-ND; URL: https://www.digikey.com/product-detail/en/micro-commercial-co/1N4448WX-TP/1N4448WXTPMSCT-ND/789338
D7 = INJ-2-OUT: Manufacturer_Name: Osram; Manufacturer_Part_Number: LH R974-LP-1; Digikey Part Number: 475-1415-1-ND; URL: https://www.digikey.com/product-detail/en/osram-opto-semiconductors-inc/LH-R974-LP-1/475-1415-1-ND/1802604
D8 = INJ-3-OUT: Manufacturer_Name: Osram; Manufacturer_Part_Number: LH R974-LP-1; Digikey Part Number: 475-1415-1-ND; URL: https://www.digikey.com/product-detail/en/osram-opto-semiconductors-inc/LH-R974-LP-1/475-1415-1-ND/1802604
D9 = IGN-4-OUT: Manufacturer_Name: Osram; Manufacturer_Part_Number: LH R974-LP-1; Digikey Part Number: 475-1415-1-ND; URL: https://www.digikey.com/product-detail/en/osram-opto-semiconductors-inc/LH-R974-LP-1/475-1415-1-ND/1802604
D10 = IGN-3-OUT: Manufacturer_Name: Osram; Manufacturer_Part_Number: LH R974-LP-1; Digikey Part Number: 475-1415-1-ND; URL: https://www.digikey.com/product-detail/en/osram-opto-semiconductors-inc/LH-R974-LP-1/475-1415-1-ND/1802604
D12 = 1n4448: Manufacturer_Name: MCC; Manufacturer_Part_Number: 1N4448WX-TP; Digikey Part Number: 1N4448WXTPMSCT-ND; URL: https://www.digikey.com/product-detail/en/micro-commercial-co/1N4448WX-TP/1N4448WXTPMSCT-ND/789338
D13 D20 = MM3Z5V1ST1G: Manufacturer_Name: On Semi; Part #: MM3Z5V1ST1G; Digikey Part Number: MM3Z5V1ST1GOSCT-ND; Manufacturer_Part_Number: MM3Z5V1ST1G; URL: https://www.digikey.com/product-detail/en/on-semiconductor/MM3Z5V1ST1G/MM3Z5V1ST1GOSCT-ND/964547
D16-D19 = 1n4148: Manufacturer_Name: ONSEMI; Manufacturer_Part_Number: S110FA; Digikey Part Number: S110FACT-ND; URL: https://www.digikey.com/en/products/detail/on-semiconductor/S110FA/5892098
F1 F2 = Polyfuse: Manufacturer_Name: Bel Fuse; Manufacturer_Part_Number: 0ZCC0050FF2C; Digikey Part Number: 507-1361-1-ND; URL: https://www.digikey.com.au/product-detail/en/bel-fuse-inc/0ZCC0050FF2C/507-1361-1-ND/1560228
JP1 = Ignition Voltage: Manufacturer_Name: Harwin Inc; Manufacturer_Part_Number: M20-9990345; Digikey Part Number: 952-2263-ND; URL: https://www.digikey.com.au/products/en?keywords=M20-9990345
JP2 JP3 = VR-HALL: Manufacturer_Name: Harwin Inc; Manufacturer_Part_Number: M20-9990345; Digikey Part Number: 952-2263-ND; URL: https://www.digikey.com.au/products/en?keywords=M20-9990345
JP4 JP5 = PULL-UP: Manufacturer_Name: Harwin Inc; Manufacturer_Part_Number: M20-9990245; Digikey Part Number: 952-2261-ND; URL: https://www.digikey.com.au/products/en?keywords=M20-9990245
JP6 = FAN-OUT: description: Jumper 2 Pin; Contributor: amir slz; sourceId: neOM8uspn; timeStamp: 1461241431; spicePre: J; spiceSymbolName: JUMPER 2X1 (PIN= 2.54) SMD(0805)
JP7 = FUELPUMP-OUT: description: Jumper 2 Pin; Contributor: amir slz; sourceId: neOM8uspn; timeStamp: 1461241431; spicePre: J; spiceSymbolName: JUMPER 2X1 (PIN= 2.54) SMD(0805)
JP8 = TACHO-OUT: description: Jumper 2 Pin; Contributor: amir slz; sourceId: neOM8uspn; timeStamp: 1461241431; spicePre: J; spiceSymbolName: JUMPER 2X1 (PIN= 2.54) SMD(0805)
JP9 = Clutch_in: description: Jumper 2 Pin; Contributor: amir slz; sourceId: neOM8uspn; timeStamp: 1461241431; spicePre: J; spiceSymbolName: JUMPER 2X1 (PIN= 2.54) SMD(0805)
JP12 = MCU-D2: description: Jumper 2 Pin; Contributor: amir slz; sourceId: neOM8uspn; timeStamp: 1461241431; spicePre: J; spiceSymbolName: JUMPER 2X1 (PIN= 2.54) SMD(0805)
Q1-Q3 = SSM3K357R: Manufacturer_Name: Toshiba; Datasheet: https://www.mouser.com/datasheet/2/408/SSM3K357R_datasheet_en_20180124-1316146.pdf; Digikey Part Number: SSM3K357RLFCT-ND; Manufacturer_Part_Number: SSM3K357R; URL: https://www.digikey.com.au/product-detail/en/toshiba-semiconductor-and-storage/SSM3K357RLF/SSM3K357RLFCT-ND/8611183
Q4-Q7 = Device_Q_NMOS_GDS: Contributor: amir slz; spicePre: Q; spiceSymbolName: Device_Q_NMOS_GDS
Q8-Q11 = Q_NMOS_GDS: Contributor: amir slz; spicePre: Q; spiceSymbolName: Device_Q_NMOS_GDS
R1-R4 R15 R16 R19 R20 R49 R50 R60 R61 = 100k: Manufacturer_Name: Yageo; Manufacturer_Part_Number: RC0805FR-07100KL; Digikey Part Number: 311-100KCRCT-ND; URL: https://www.digikey.com/product-detail/en/yageo/RC0805FR-07100KL/311-100KCRCT-ND/730491
R5-R8 R17 R18 R21 R22 R29 R37 R41 R42 R47 R48 R53 R54 R56 R57 = 1k: Manufacturer_Name: Yageo; Manufacturer_Part_Number: RC0805FR-071KL; Digikey Part Number: 311-1.00KCRCT-ND
  R5-R8 R17 R18 R21 R22 R29 R37 R41 R42 R47 R48 R53 R56 R57: URL: https://www.digikey.com/product-detail/en/yageo/RC0805FR-071KL/311-1.00KCRCT-ND/730391
R9-R12 R23-R26 R33 = 2.4k: Manufacturer_Name: Yageo; Manufacturer_Part_Number: RC0805FR-072K4L; Digikey Part Number: 311-2.40KCRCT-ND; URL: https://www.digikey.com/product-detail/en/yageo/RC0805FR-072K4L/311-2.40KCRCT-ND/730637
R13 R14 R27 R28 = 10: Manufacturer_Name: Yageo; Manufacturer_Part_Number: RC1206FR-0710RL; Digikey Part Number: 311-10.0FRCT-ND; URL: https://www.digikey.com/en/products/detail/yageo/RC1206FR-0710RL/728482
R30 = 3.9k: Manufacturer_Name: Yageo; Manufacturer_Part_Number: RC0805FR-073K9L; Digikey Part Number: 311-3.90KCRCT-ND; URL: https://www.digikey.com/product-detail/en/yageo/RC0805FR-073K9L/311-3.90KCRCT-ND/730785
R31 R32 R34 R38-R40 R55 R62 R63 = 470: Manufacturer_Name: Panasonic; Manufacturer_Part_Number: ERJ-6ENF4700V; URL: https://www.digikey.com/product-detail/en/panasonic-electronic-components/ERJ-6ENF4700V/P470CCT-ND/1746871; Digikey Part Number: P470CCT-ND
R35 R36 = 2.49k: Manufacturer_Name: Yageo; Manufacturer_Part_Number: RT0805BRD072K49L; Digikey Part Number: YAG1854CT-ND; URL: https://www.digikey.com/product-detail/en/yageo/RT0805BRD072K49L/YAG1854CT-ND/5139302
R43 R44 = 220: Manufacturer_Name: Yageo; Manufacturer_Part_Number: RC0805FR-07220RL; Digikey Part Number: 311-220CRCT-ND; URL: https://www.digikey.com/product-detail/en/yageo/RC0805FR-07220RL/311-220CRCT-ND/730688
R46 = 120: Manufacturer_Name: Yageo; Manufacturer_Part_Number: RC0805FR-07120RL; Digikey Part Number: 311-120CRCT-ND; URL: https://www.digikey.com/product-detail/en/yageo/RC0805FR-07120RL/311-120CRCT-ND/730522
R51 = 10k: Manufacturer_Name: Yageo; Manufacturer_Part_Number: RC0805JR-0710KL; Digikey Part Number: 311-10KARCT-ND; URL: https://www.digikey.com/product-detail/en/yageo/RC0805JR-0710KL/311-10KARCT-ND/731188
R52 = 2k: Manufacturer_Name: Yageo; Manufacturer_Part_Number: RC0805FR-072KL; Digikey Part Number: 311-2.00KCRCT-ND; URL: https://www.digikey.com/product-detail/en/yageo/RC0805FR-072KL/311-2.00KCRCT-ND/730611
R59 = 10K: Manufacturer: YAGEO; Manufacturer Part: RC0805FR-072K74L; nameAlias: Resistance (Ohms); Supplier: LCSC; Supplier Part: C137554; JLCPCB Part Class: Extended Part; spicePre: R; spiceSymbolName: RC0805FR-072K74L
SW3 = RST: Manufacturer: null; Manufacturer Part: BDSwitch-2pin-1CH-1r27-SMD-V; Contributor: lcsc; Supplier: LCSC; Supplier Part: C9900022896; JLCPCB Part Class: Extended Part; spicePre: S; spiceSymbolName: BDSWITCH-2PIN-1CH-1R27-SMD-V
U2 U4 = TC4424A: Manufacturer_Name: IXYS; Manufacturer_Part_Number: IXDN602SIATR; Digikey Part Number: 212-IXDN602SIACT-ND; URL: https://www.digikey.com/en/products/detail/ixys-integrated-circuits-division/IXDN602SIATR/2424695
U5 = MPX4250: Manufacturer_Name: NXP; Manufacturer_Part_Number: MPX4250AP; Digikey Part Number: MPX4250AP-ND; URL: https://www.digikey.com.au/product-detail/en/nxp-usa-inc/MPX4250AP/MPX4250AP-ND/464053
U6 = SP720: Manufacturer_Name: Littelfuse; Manufacturer_Part_Number: SP720ABTG; Datasheet: https://m.littelfuse.com//media/electronics/datasheets/tvs_diode_arrays/littelfuse_tvs_diode_array_sp720_datasheet.pdf.pdf; Digikey Part Number: F3162CT-ND; URL: https://www.digikey.com/product-detail/en/littelfuse-inc/SP720ABTG/F3162CT-ND/1984458
U7 U8 = Header: Manufacturer Part: Male Header 2 pin; Contributor: amir slz; spicePre: U; spiceSymbolName: 1X8 Header (Pin = 2.54)
U10 = IDC2.54-2-10: Manufacturer: Megastar(兆星); Manufacturer Part: ZX-IDC2.54-2-10PZZ; Contributor: lcsc; Supplier: LCSC; Supplier Part: C7501245; JLCPCB Part Class: Extended Part; spicePre: U; spiceSymbolName: ZX-IDC2.54-2-10PZZ
U13 = Power Input: Manufacturer: ReliaPro; Manufacturer Part: PH-12AW; Contributor: amir slz; spicePre: X; Supplier Part: C8883; spiceSymbolName: PHONIX 2PIN (5.08mm)
A1 = Pololu_Breakout_DRV8825: Datasheet: https://www.pololu.com/product/2982
J8 = 12V_SW: Spice_Primitive: J; Spice_Model: Conn_01x03; Spice_Netlist_Enabled: Y